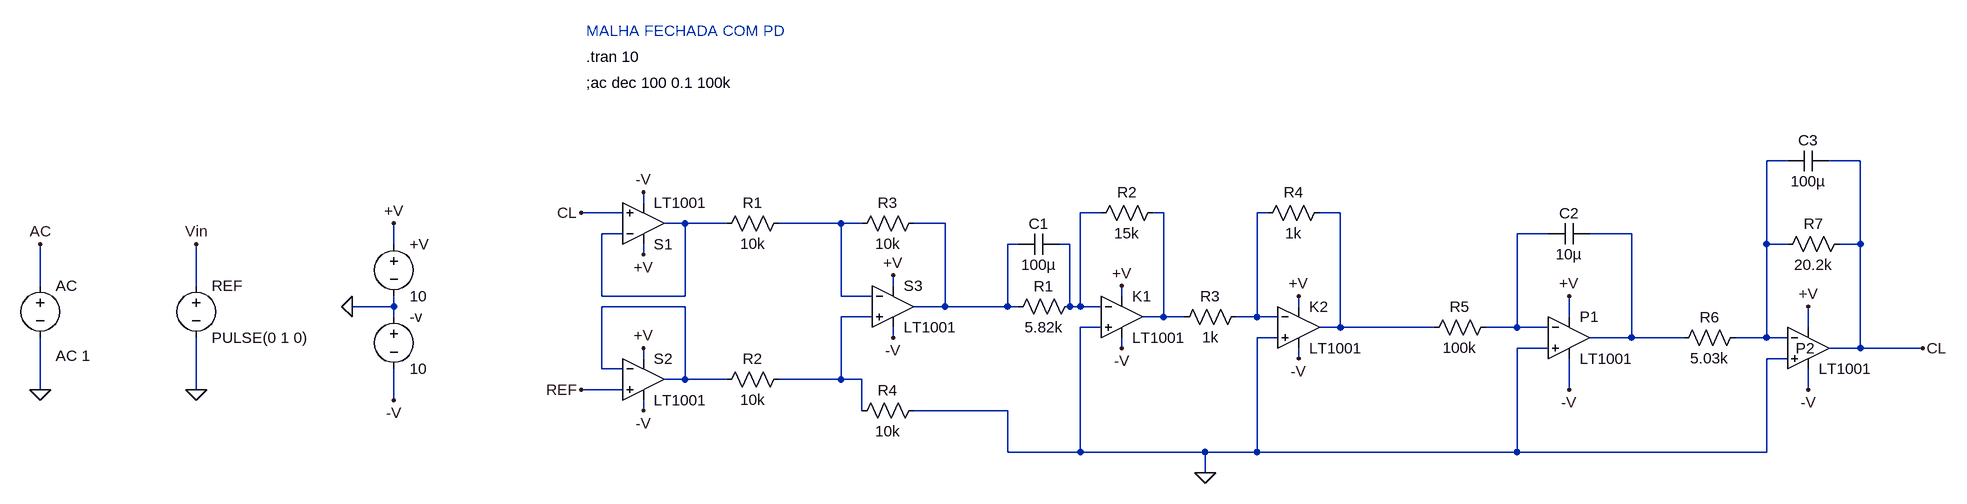
[diagram p0: schematic CL_PD.asc]
CL_PD.asc, the LTspice schematic file:
Version 4
SHEET 1 1932 680
WIRE 1504 -48 1472 -48
WIRE 1616 -48 1568 -48
WIRE -256 16 -256 0
WIRE -288 32 -352 32
WIRE 448 32 416 32
WIRE 544 32 528 32
WIRE 704 32 688 32
WIRE 816 32 784 32
WIRE -192 48 -224 48
WIRE -128 48 -192 48
WIRE 48 48 -48 48
WIRE 80 48 48 48
WIRE 208 48 160 48
WIRE -288 64 -320 64
WIRE 1136 64 1088 64
WIRE 1264 64 1200 64
WIRE -640 80 -640 48
WIRE 320 80 304 80
WIRE 400 80 384 80
WIRE 1472 80 1472 -48
WIRE 1504 80 1472 80
WIRE 1616 80 1616 -48
WIRE 1616 80 1584 80
WIRE -256 96 -256 80
WIRE -1184 144 -1184 80
WIRE -944 144 -944 80
WIRE 128 144 128 128
WIRE -320 160 -320 64
WIRE -192 160 -192 48
WIRE -192 160 -320 160
WIRE 48 160 48 48
WIRE 96 160 48 160
WIRE 480 160 480 144
WIRE -640 176 -640 160
WIRE -640 176 -704 176
WIRE -192 176 -320 176
WIRE 208 176 208 48
WIRE 208 176 160 176
WIRE 304 176 304 80
WIRE 304 176 208 176
WIRE 320 176 304 176
WIRE 400 176 400 80
WIRE 416 176 416 32
WIRE 416 176 400 176
WIRE 448 176 416 176
WIRE 752 176 752 160
WIRE -640 192 -640 176
WIRE 96 192 48 192
WIRE 544 192 544 32
WIRE 544 192 512 192
WIRE 576 192 544 192
WIRE 688 192 688 32
WIRE 688 192 656 192
WIRE 720 192 688 192
WIRE 1168 192 1168 160
WIRE 448 208 416 208
WIRE 816 208 816 32
WIRE 816 208 784 208
WIRE 960 208 816 208
WIRE 1088 208 1088 64
WIRE 1088 208 1040 208
WIRE 1136 208 1088 208
WIRE 1536 208 1536 176
WIRE 128 224 128 208
WIRE 720 224 688 224
WIRE 1264 224 1264 64
WIRE 1264 224 1200 224
WIRE 1344 224 1264 224
WIRE 1472 224 1472 80
WIRE 1472 224 1424 224
WIRE 1504 224 1472 224
WIRE 480 240 480 224
WIRE 1136 240 1088 240
WIRE 1616 240 1616 80
WIRE 1616 240 1568 240
WIRE 1712 240 1616 240
WIRE -256 256 -256 240
WIRE 752 256 752 240
WIRE 1504 256 1472 256
WIRE -320 272 -320 176
WIRE -288 272 -320 272
WIRE -192 288 -192 176
WIRE -192 288 -224 288
WIRE -128 288 -192 288
WIRE 48 288 48 192
WIRE 48 288 -48 288
WIRE 80 288 48 288
WIRE -1184 304 -1184 224
WIRE -944 304 -944 224
WIRE -288 304 -352 304
WIRE 1168 304 1168 256
WIRE 1536 304 1536 272
WIRE -640 320 -640 272
WIRE -256 336 -256 320
WIRE 80 336 80 288
WIRE 304 336 160 336
WIRE 304 400 304 336
WIRE 416 400 416 208
WIRE 416 400 304 400
WIRE 608 400 416 400
WIRE 688 400 688 224
WIRE 688 400 608 400
WIRE 1088 400 1088 240
WIRE 1088 400 688 400
WIRE 1472 400 1472 256
WIRE 1472 400 1088 400
WIRE 608 432 608 400
FLAG -352 304 REF
FLAG -256 0 -V
FLAG 128 128 +V
FLAG -256 240 +V
FLAG -256 96 +V
FLAG 128 224 -V
FLAG -256 336 -V
FLAG -352 32 CL
FLAG -640 48 +V
FLAG -640 320 -V
FLAG -704 176 0
FLAG -944 304 0
FLAG -944 80 Vin
FLAG 1168 160 +V
FLAG 1536 176 +V
FLAG 1168 304 -V
FLAG 1536 304 -V
FLAG 608 432 0
FLAG 480 144 +V
FLAG 752 160 +V
FLAG 480 240 -V
FLAG 752 256 -V
FLAG 1712 240 CL
FLAG -1184 304 0
FLAG -1184 80 AC
SYMBOL Opamps\\LT1001 -256 112 M180
SYMATTR InstName S1
SYMBOL Opamps\\LT1001 128 112 R0
SYMATTR InstName S3
SYMBOL Opamps\\LT1001 -256 224 R0
SYMATTR InstName S2
SYMBOL res -32 32 R90
WINDOW 0 0 56 VBottom 2
WINDOW 3 32 56 VTop 2
SYMATTR InstName R1
SYMATTR Value 10k
SYMBOL res -32 272 R90
WINDOW 0 0 56 VBottom 2
WINDOW 3 32 56 VTop 2
SYMATTR InstName R2
SYMATTR Value 10k
SYMBOL res 176 32 R90
WINDOW 0 0 56 VBottom 2
WINDOW 3 32 56 VTop 2
SYMATTR InstName R3
SYMATTR Value 10k
SYMBOL res 176 320 R90
WINDOW 0 0 56 VBottom 2
WINDOW 3 32 56 VTop 2
SYMATTR InstName R4
SYMATTR Value 10k
SYMBOL voltage -640 64 R0
WINDOW 123 0 0 Left 2
WINDOW 39 0 0 Left 2
SYMATTR InstName +V
SYMATTR Value 10
SYMBOL voltage -640 176 R0
WINDOW 123 0 0 Left 2
WINDOW 39 0 0 Left 2
SYMATTR InstName -v
SYMATTR Value 10
SYMBOL voltage -944 128 R0
WINDOW 123 0 0 Left 2
WINDOW 39 0 0 Left 2
SYMATTR InstName REF
SYMATTR Value PULSE(0 1 0)
SYMBOL Opamps\\LT1001 1168 160 R0
SYMATTR InstName P1
SYMBOL Opamps\\LT1001 1536 176 R0
WINDOW 0 -19 64 Left 2
SYMATTR InstName P2
SYMBOL res 1056 192 R90
WINDOW 0 0 56 VBottom 2
WINDOW 3 32 56 VTop 2
SYMATTR InstName R5
SYMATTR Value 100k
SYMBOL res 1440 208 R90
WINDOW 0 0 56 VBottom 2
WINDOW 3 32 56 VTop 2
SYMATTR InstName R6
SYMATTR Value 5.03k
SYMBOL res 1600 64 R90
WINDOW 0 0 56 VBottom 2
WINDOW 3 32 56 VTop 2
SYMATTR InstName R7
SYMATTR Value 20.2k
SYMBOL cap 1568 -64 R90
WINDOW 0 0 32 VBottom 2
WINDOW 3 32 32 VTop 2
SYMATTR InstName C3
SYMATTR Value 100µ
SYMBOL cap 1200 48 R90
WINDOW 0 0 32 VBottom 2
WINDOW 3 32 32 VTop 2
SYMATTR InstName C2
SYMATTR Value 10µ
SYMBOL Opamps\\LT1001 480 128 R0
SYMATTR InstName K1
SYMBOL Opamps\\LT1001 752 144 R0
SYMATTR InstName K2
SYMBOL res 416 160 R90
WINDOW 0 0 56 VBottom 2
WINDOW 3 32 56 VTop 2
SYMATTR InstName R1
SYMATTR Value 5.82k
SYMBOL cap 384 64 R90
WINDOW 0 0 32 VBottom 2
WINDOW 3 32 32 VTop 2
SYMATTR InstName C1
SYMATTR Value 100µ
SYMBOL res 672 176 R90
WINDOW 0 0 56 VBottom 2
WINDOW 3 32 56 VTop 2
SYMATTR InstName R3
SYMATTR Value 1k
SYMBOL res 544 16 R90
WINDOW 0 0 56 VBottom 2
WINDOW 3 32 56 VTop 2
SYMATTR InstName R2
SYMATTR Value 15k
SYMBOL res 800 16 R90
WINDOW 0 0 56 VBottom 2
WINDOW 3 32 56 VTop 2
SYMATTR InstName R4
SYMATTR Value 1k
SYMBOL voltage -1184 128 R0
WINDOW 123 24 124 Left 2
WINDOW 39 0 0 Left 2
SYMATTR Value2 AC 1
SYMATTR InstName AC
SYMATTR Value ""
TEXT -344 -248 Left 2 ;MALHA FECHADA COM PD
TEXT -344 -208 Left 2 !.tran 10
TEXT -344 -168 Left 2 !;ac dec 100 0.1 100k

The netlist it stands for:
* CL_PD.asc
XS1 CL N006 +V -V N006 LT1001  ; pins In+ In- V+ V- OUT
XS3 N012 N007 +V -V N008 LT1001  ; pins In+ In- V+ V- OUT
XS2 REF N011 +V -V N011 LT1001  ; pins In+ In- V+ V- OUT
R1 N007 N006 10k
R2 N012 N011 10k
R3 N008 N007 10k
R4 0 N012 10k
V§+V +V 0 10
V§-v 0 -V 10
V§REF Vin 0 PULSE(0 1 0)
XP1 0 N009 +V -V N010 LT1001  ; pins In+ In- V+ V- OUT
XP2 0 N001 +V -V CL LT1001  ; pins In+ In- V+ V- OUT
R5 N009 N005 100k
R6 N001 N010 5.03k
R7 CL N001 20.2k
C3 CL N001 100µ
C2 N010 N009 10µ
XK1 0 N002 +V -V N003 LT1001  ; pins In+ In- V+ V- OUT
XK2 0 N004 +V -V N005 LT1001  ; pins In+ In- V+ V- OUT
R1 N002 N008 5.82k
C1 N002 N008 100µ
R3 N004 N003 1k
R2 N003 N002 15k
R4 N005 N004 1k
V§AC AC 0 AC 1
* MALHA FECHADA COM PD
.tran 10
;ac dec 100 0.1 100k
.lib LTC.lib
.backanno
.end